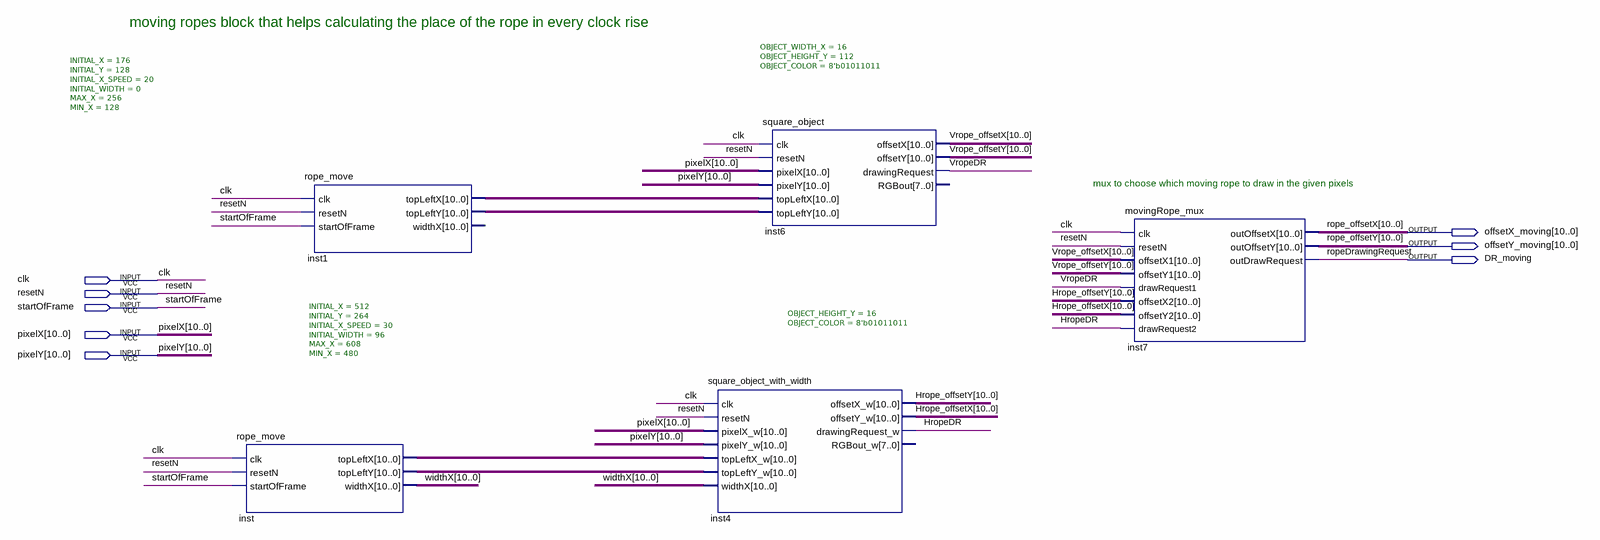
[diagram p0: schematic sheet]
// Quartus schematic movingRopeBlock.bdf as structural Verilog: 5 symbols, 8 pins
module movingRopeBlock (
  input  clk,
  input  resetN,
  input  startOfFrame,
  input  [10:0] pixelX,
  input  [10:0] pixelY,
  output [10:0] offsetX_moving,
  output [10:0] offsetY_moving,
  output DR_moving
);

  wire HropeDR, VropeDR;
  wire [10:0] Hrope_offsetX, Hrope_offsetY, inst1_topleftx, inst1_toplefty, inst_topleftx, inst_toplefty,
       Vrope_offsetX, Vrope_offsetY, widthX;

  rope_move #(.INITIAL_X(512), .INITIAL_Y(264), .INITIAL_X_SPEED(30), .INITIAL_WIDTH(96), .MAX_X(608), .MIN_X(480)) inst (
    .clk(clk), .resetN(resetN), .startOfFrame(startOfFrame), .topLeftX(inst_topleftx),
    .topLeftY(inst_toplefty), .widthX(widthX));
  rope_move #(.INITIAL_X(176), .INITIAL_Y(128), .INITIAL_X_SPEED(20), .INITIAL_WIDTH(0), .MAX_X(256), .MIN_X(128)) inst1 (
    .clk(clk), .resetN(resetN), .startOfFrame(startOfFrame), .topLeftX(inst1_topleftx),
    .topLeftY(inst1_toplefty));  // open: widthX
  square_object_with_width #(.OBJECT_HEIGHT_Y(16), .OBJECT_COLOR(8'b01011011)) inst4 (
    .clk(clk), .resetN(resetN), .pixelX_w(pixelX), .pixelY_w(pixelY), .topLeftX_w(inst_topleftx),
    .topLeftY_w(inst_toplefty), .widthX(widthX), .offsetX_w(Hrope_offsetY), .offsetY_w(Hrope_offsetX),
    .drawingRequest_w(HropeDR));  // open: RGBout_w
  square_object #(.OBJECT_WIDTH_X(16), .OBJECT_HEIGHT_Y(112), .OBJECT_COLOR(8'b01011011)) inst6 (
    .clk(clk), .resetN(resetN), .pixelX(pixelX), .pixelY(pixelY), .topLeftX(inst1_topleftx),
    .topLeftY(inst1_toplefty), .offsetX(Vrope_offsetX), .offsetY(Vrope_offsetY), .drawingRequest(VropeDR));  // open: RGBout
  movingRope_mux inst7 (
    .clk(clk), .resetN(resetN), .offsetX1(Vrope_offsetX), .offsetY1(Vrope_offsetY), .drawRequest1(VropeDR),
    .offsetX2(Hrope_offsetY), .offsetY2(Hrope_offsetX), .drawRequest2(HropeDR), .outOffsetX(offsetX_moving),
    .outOffsetY(offsetY_moving), .outDrawRequest(DR_moving));

  // Other names for the same wires on the sheet: rope_offsetX[10:0] = offsetX_moving;
  //   rope_offsetY[10:0] = offsetY_moving; ropeDrawingRequest = DR_moving

  // Notes on the sheet:
  //   moving ropes block that helps calculating the place of the rope in every clock rise
  //   mux to choose which moving rope to draw in the given pixels
endmodule
